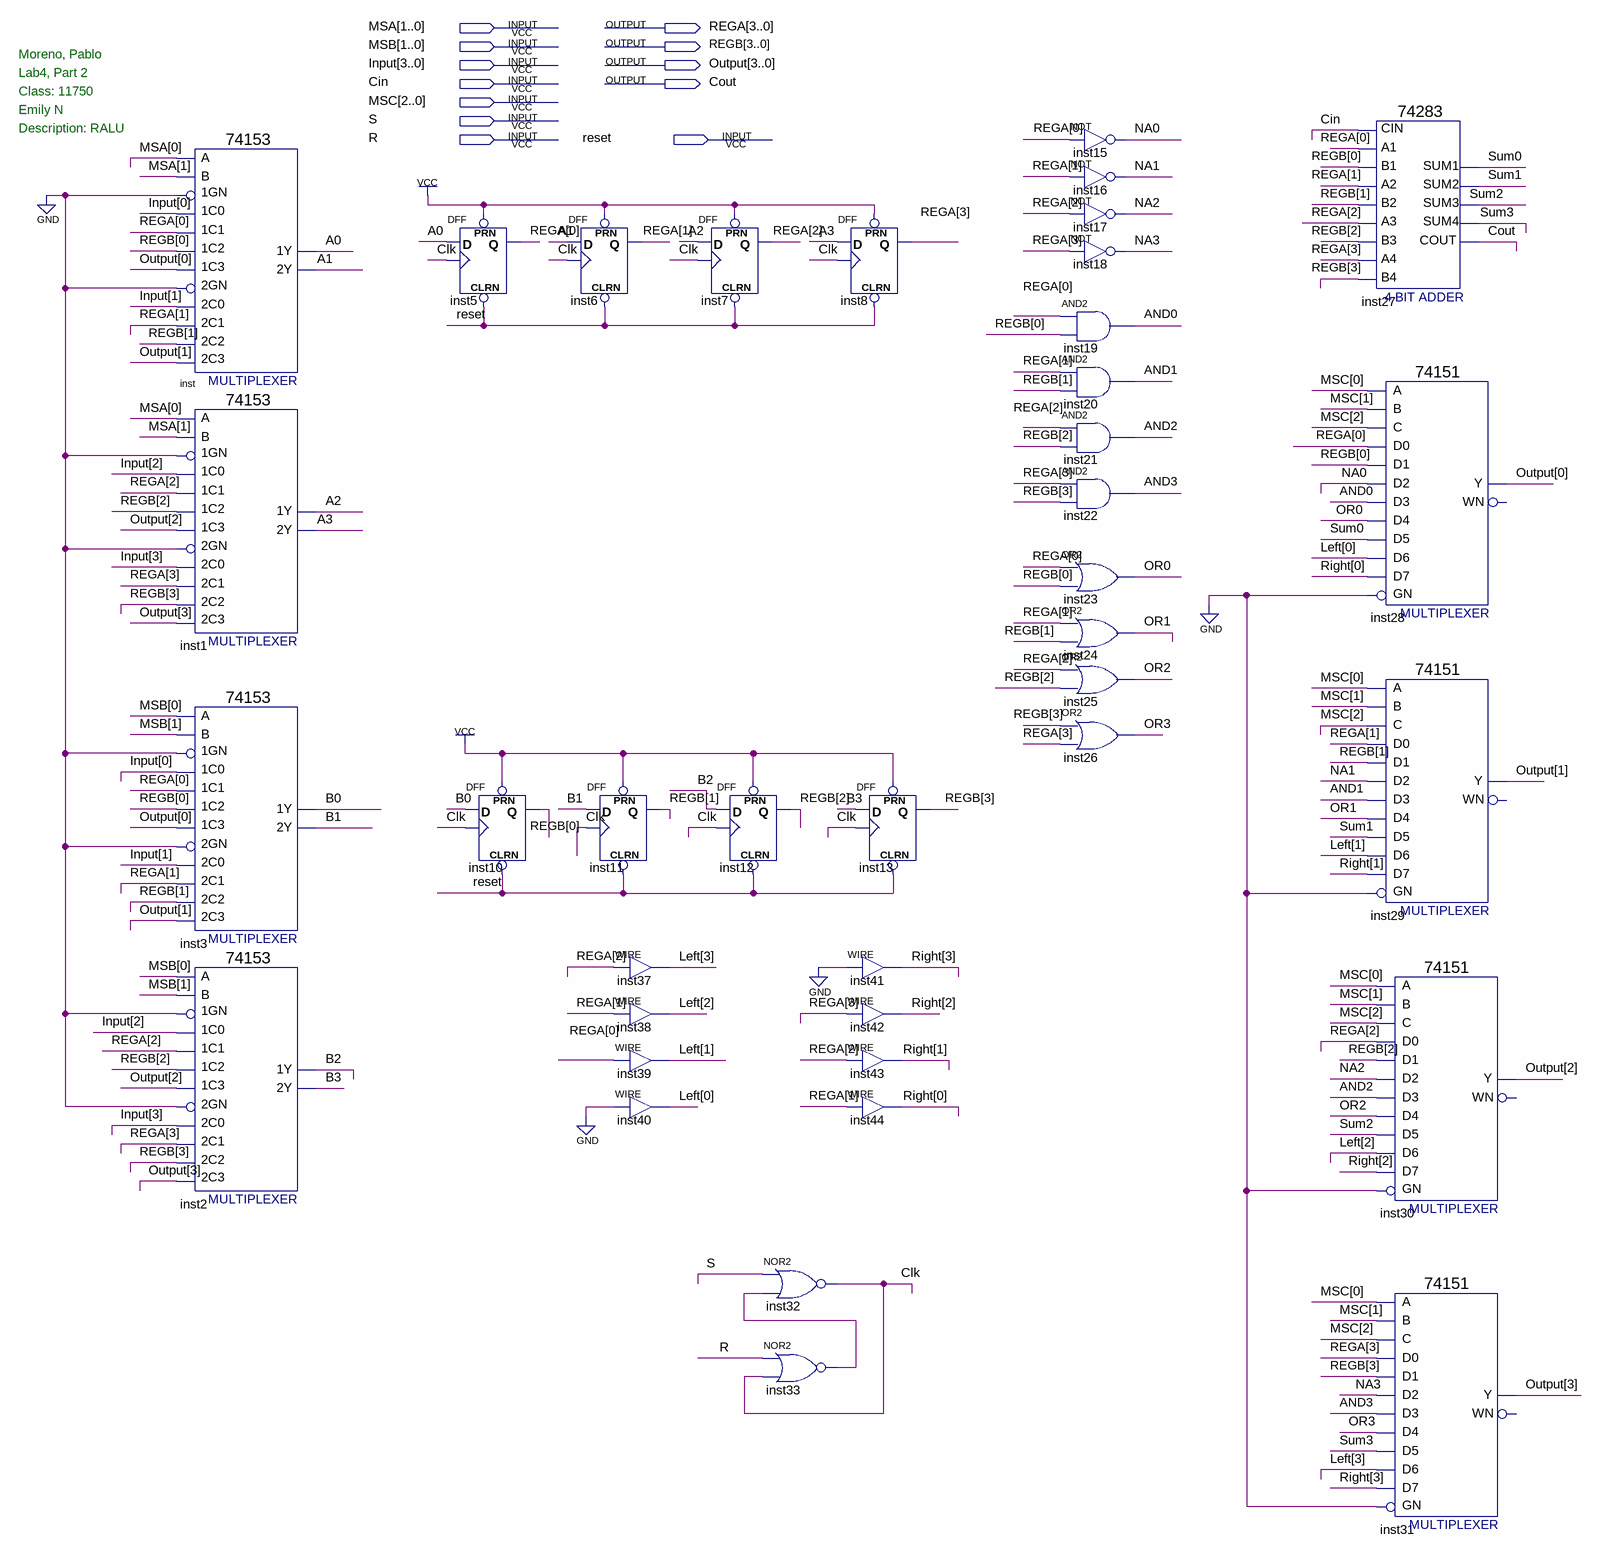
[diagram p0: schematic sheet]
// Quartus schematic Lab4_RALU.bdf as structural Verilog: 39 symbols, 12 pins
module Lab4_RALU (
  input  [1:0] MSA,
  input  [1:0] MSB,
  input  [3:0] Input,
  input  Cin,
  input  [2:0] MSC,
  input  S,
  input  R,
  input  reset,
  output [3:0] REGA,
  output [3:0] REGB,
  output [3:0] Output,
  output Cout
);

  wire A0, A1, A2, A3, AND0, AND1, AND2, AND3, B0, B1, B2, B3, Clk, inst33_out, NA0, NA1, NA2, NA3, OR0, OR1,
       OR2, OR3, Sum0, Sum1, Sum2, Sum3;
  wire [3:0] Left, Right;

  \74153  inst (
    .\1C1 (REGA[0]), .\1GN (1'b0), .\1C0 (Input[0]), .\2C0 (Input[1]), .\2GN (1'b0), .\2C2 (REGB[1]),
    .\1C2 (REGB[0]), .\1C3 (Output[0]), .B(MSA[1]), .A(MSA[0]), .\2C1 (REGA[1]), .\2C3 (Output[1]),
    .\1Y (A0), .\2Y (A1));
  \74153  inst1 (
    .\1C1 (REGA[2]), .\1GN (1'b0), .\1C0 (Input[2]), .\2C0 (Input[3]), .\2GN (1'b0), .\2C2 (REGB[3]),
    .\1C2 (REGB[2]), .\1C3 (Output[2]), .B(MSA[1]), .A(MSA[0]), .\2C1 (REGA[3]), .\2C3 (Output[3]),
    .\1Y (A2), .\2Y (A3));
  \74153  inst3 (
    .\1C1 (REGA[0]), .\1GN (1'b0), .\1C0 (Input[0]), .\2C0 (Input[1]), .\2GN (1'b0), .\2C2 (REGB[1]),
    .\1C2 (REGB[0]), .\1C3 (Output[0]), .B(MSB[1]), .A(MSB[0]), .\2C1 (REGA[1]), .\2C3 (Output[1]),
    .\1Y (B0), .\2Y (B1));
  \74153  inst2 (
    .\1C1 (REGA[2]), .\1GN (1'b0), .\1C0 (Input[2]), .\2C0 (Input[3]), .\2GN (1'b0), .\2C2 (REGB[3]),
    .\1C2 (REGB[2]), .\1C3 (Output[2]), .B(MSB[1]), .A(MSB[0]), .\2C1 (REGA[3]), .\2C3 (Output[3]),
    .\1Y (B2), .\2Y (B3));
  DFF inst5 (.CLRN(reset), .CLK(Clk), .D(A0), .PRN(1'b1), .Q(REGA[0]));
  DFF inst10 (.CLRN(reset), .CLK(Clk), .D(B0), .PRN(1'b1), .Q(REGB[0]));
  DFF inst6 (.CLRN(reset), .CLK(Clk), .D(A1), .PRN(1'b1), .Q(REGA[1]));
  DFF inst11 (.CLRN(reset), .CLK(Clk), .D(B1), .PRN(1'b1), .Q(REGB[1]));
  assign Left[3] = REGA[2];  // WIRE inst37
  assign Left[2] = REGA[1];  // WIRE inst38
  assign Left[1] = REGA[0];  // WIRE inst39
  assign Left[0] = 1'b0;  // WIRE inst40
  DFF inst7 (.CLRN(reset), .CLK(Clk), .D(A2), .PRN(1'b1), .Q(REGA[2]));
  DFF inst12 (.CLRN(reset), .CLK(Clk), .D(B2), .PRN(1'b1), .Q(REGB[2]));
  nor inst32 (Clk, S, inst33_out);
  nor inst33 (inst33_out, R, Clk);
  DFF inst8 (.CLRN(reset), .CLK(Clk), .D(A3), .PRN(1'b1), .Q(REGA[3]));
  DFF inst13 (.CLRN(reset), .CLK(Clk), .D(B3), .PRN(1'b1), .Q(REGB[3]));
  assign Right[3] = 1'b0;  // WIRE inst41
  assign Right[2] = REGA[3];  // WIRE inst42
  assign Right[1] = REGA[2];  // WIRE inst43
  assign Right[0] = REGA[1];  // WIRE inst44
  not inst15 (NA0, REGA[0]);
  not inst16 (NA1, REGA[1]);
  not inst17 (NA2, REGA[2]);
  not inst18 (NA3, REGA[3]);
  and inst19 (AND0, REGA[0], REGB[0]);
  and inst20 (AND1, REGA[1], REGB[1]);
  and inst21 (AND2, REGA[2], REGB[2]);
  and inst22 (AND3, REGA[3], REGB[3]);
  or inst23 (OR0, REGA[0], REGB[0]);
  or inst24 (OR1, REGA[1], REGB[1]);
  or inst25 (OR2, REGA[2], REGB[2]);
  or inst26 (OR3, REGB[3], REGA[3]);
  \74283  inst27 (
    .CIN(Cin), .A1(REGA[0]), .A2(REGA[1]), .B2(REGB[1]), .A3(REGA[2]), .A4(REGA[3]), .B4(REGB[3]),
    .B1(REGB[0]), .B3(REGB[2]), .SUM4(Sum3), .COUT(Cout), .SUM1(Sum0), .SUM2(Sum1), .SUM3(Sum2));
  \74151  inst28 (
    .GN(1'b0), .C(MSC[2]), .B(MSC[1]), .A(MSC[0]), .D5(Sum0), .D0(REGA[0]), .D1(REGB[0]), .D4(OR0),
    .D3(AND0), .D2(NA0), .D6(Left[0]), .D7(Right[0]), .Y(Output[0]));  // open: WN
  \74151  inst29 (
    .GN(1'b0), .C(MSC[2]), .B(MSC[1]), .A(MSC[0]), .D5(Sum1), .D0(REGA[1]), .D1(REGB[1]), .D4(OR1),
    .D3(AND1), .D2(NA1), .D6(Left[1]), .D7(Right[1]), .Y(Output[1]));  // open: WN
  \74151  inst30 (
    .GN(1'b0), .C(MSC[2]), .B(MSC[1]), .A(MSC[0]), .D5(Sum2), .D0(REGA[2]), .D1(REGB[2]), .D4(OR2),
    .D3(AND2), .D2(NA2), .D6(Left[2]), .D7(Right[2]), .Y(Output[2]));  // open: WN
  \74151  inst31 (
    .GN(1'b0), .C(MSC[2]), .B(MSC[1]), .A(MSC[0]), .D5(Sum3), .D0(REGA[3]), .D1(REGB[3]), .D4(OR3),
    .D3(AND3), .D2(NA3), .D6(Left[3]), .D7(Right[3]), .Y(Output[3]));  // open: WN

  // Notes on the sheet:
  //   Moreno, Pablo
  //   Lab4, Part 2
  //   Class: 11750
  //   Emily N
  //   Description: RALU
endmodule
